# Altium schematic sheet MCU_Schematic_Winterbreak.SchDoc
size C; SheetNumber: 1; SheetTotal: 1
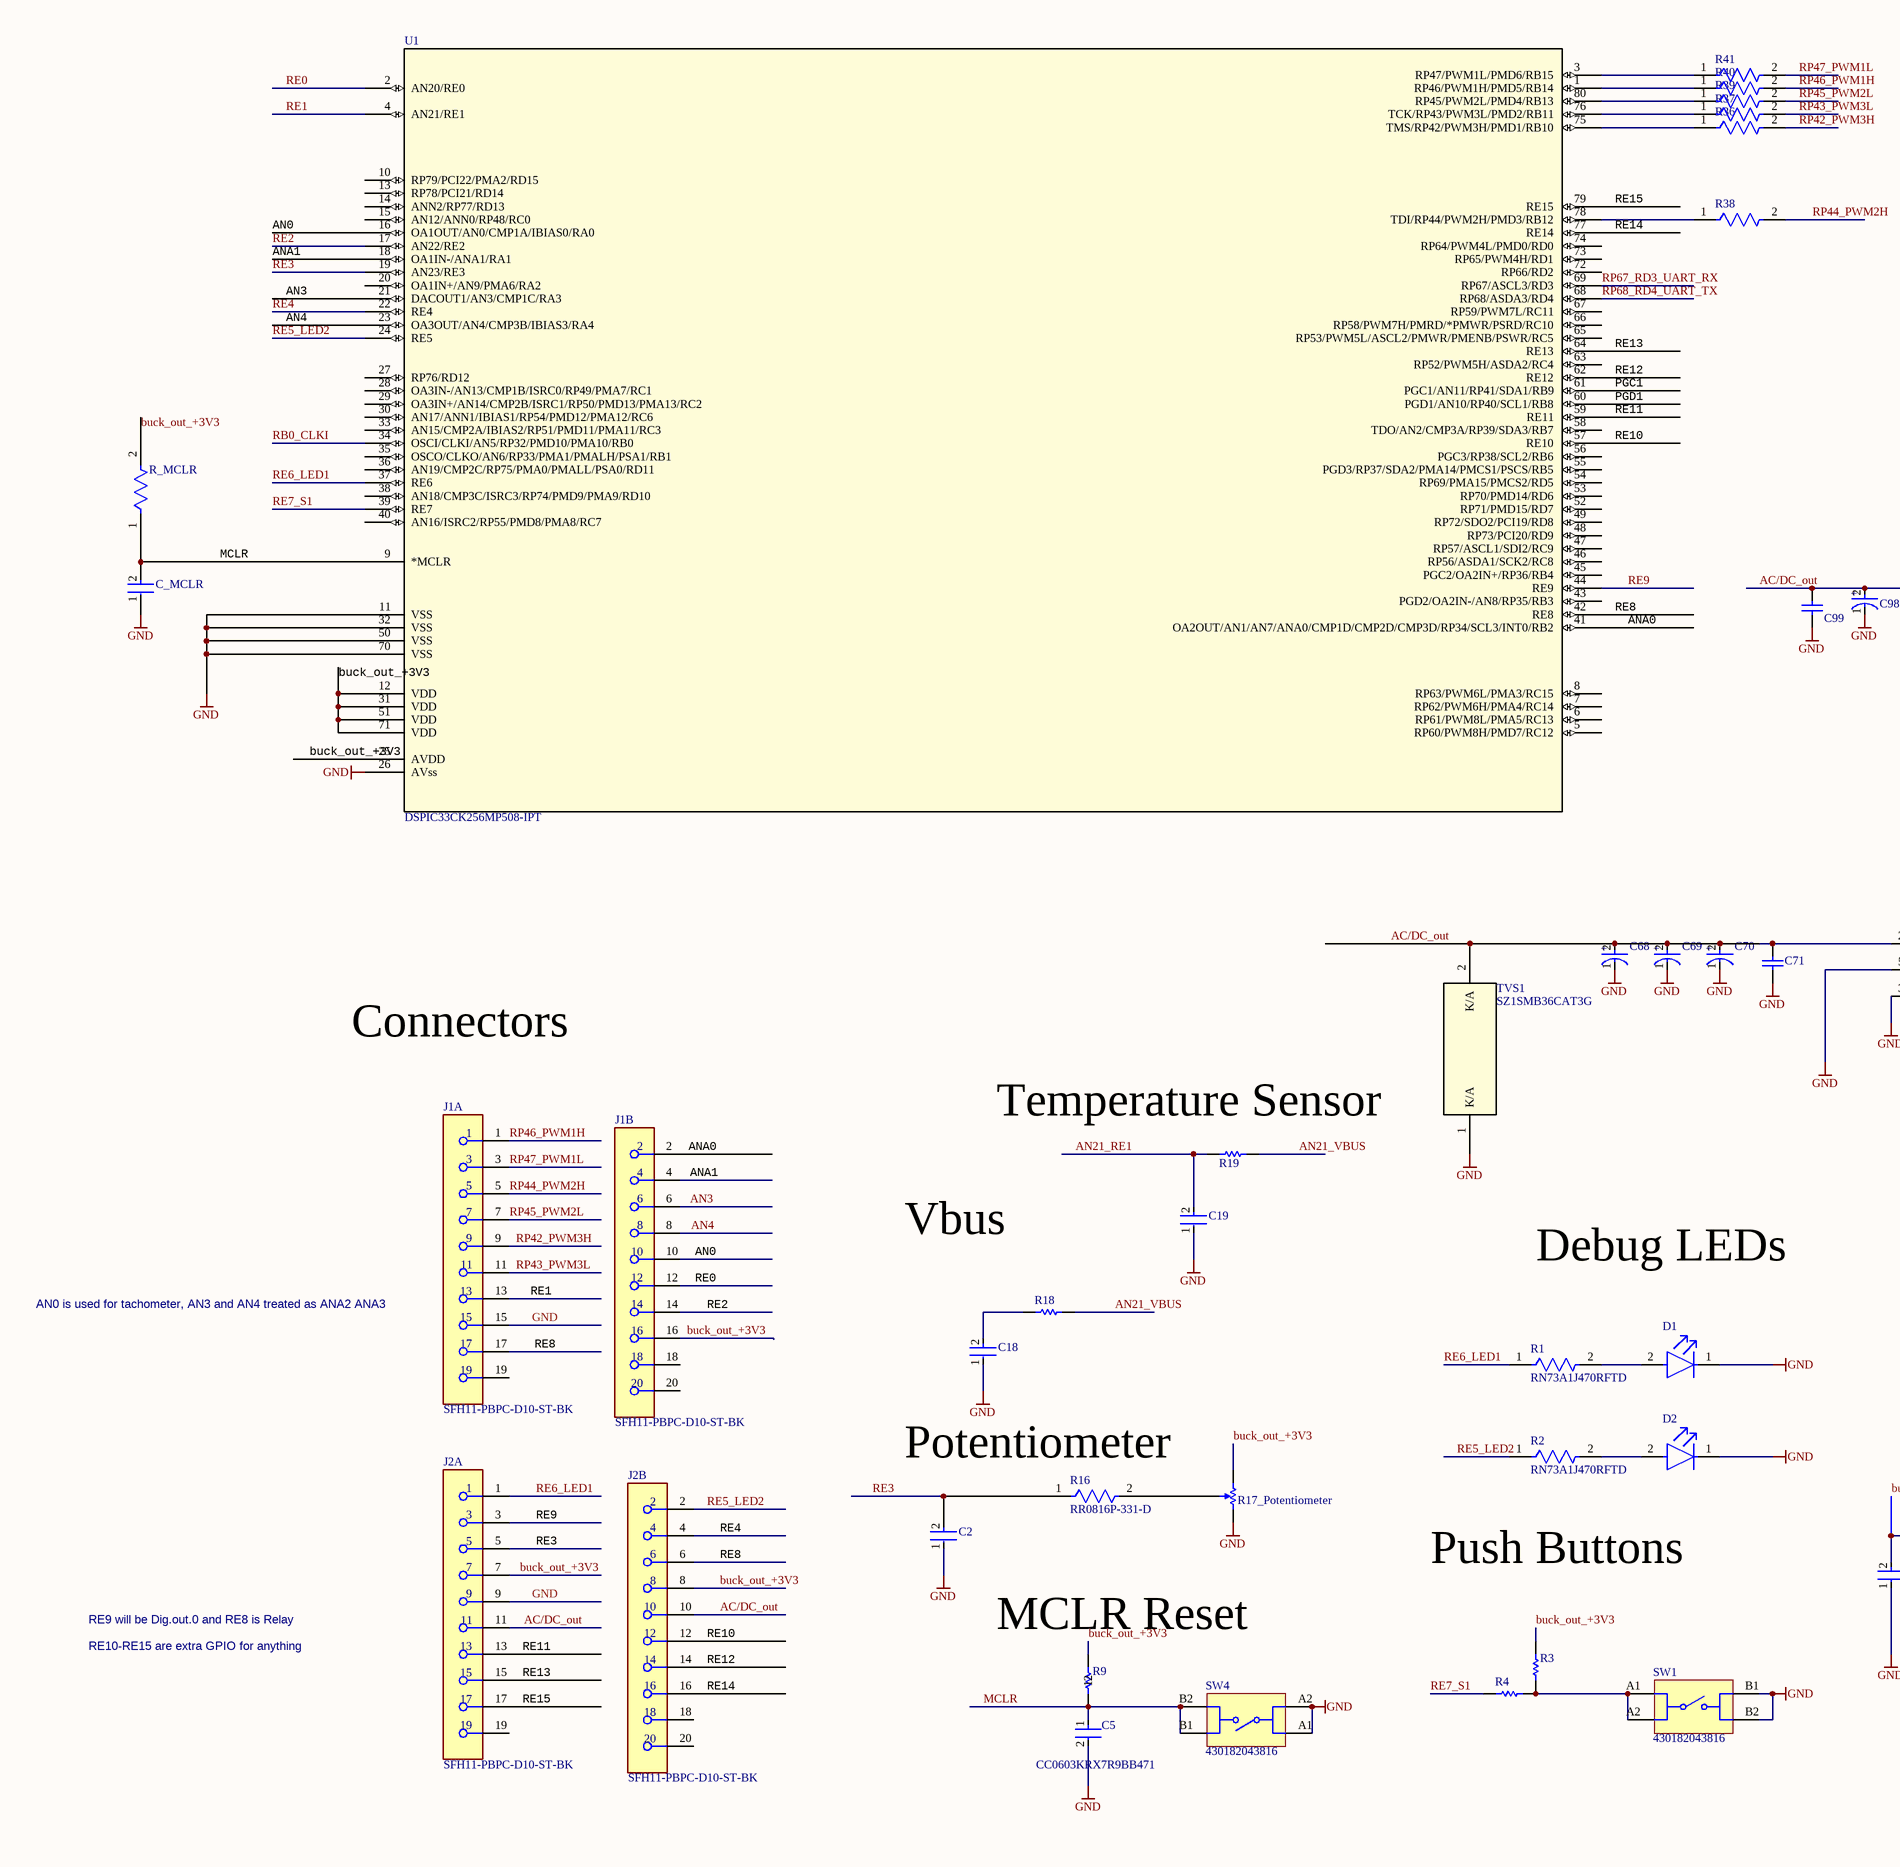
[diagram p0: MCU_Schematic_Winterbreak.SchDoc, left]
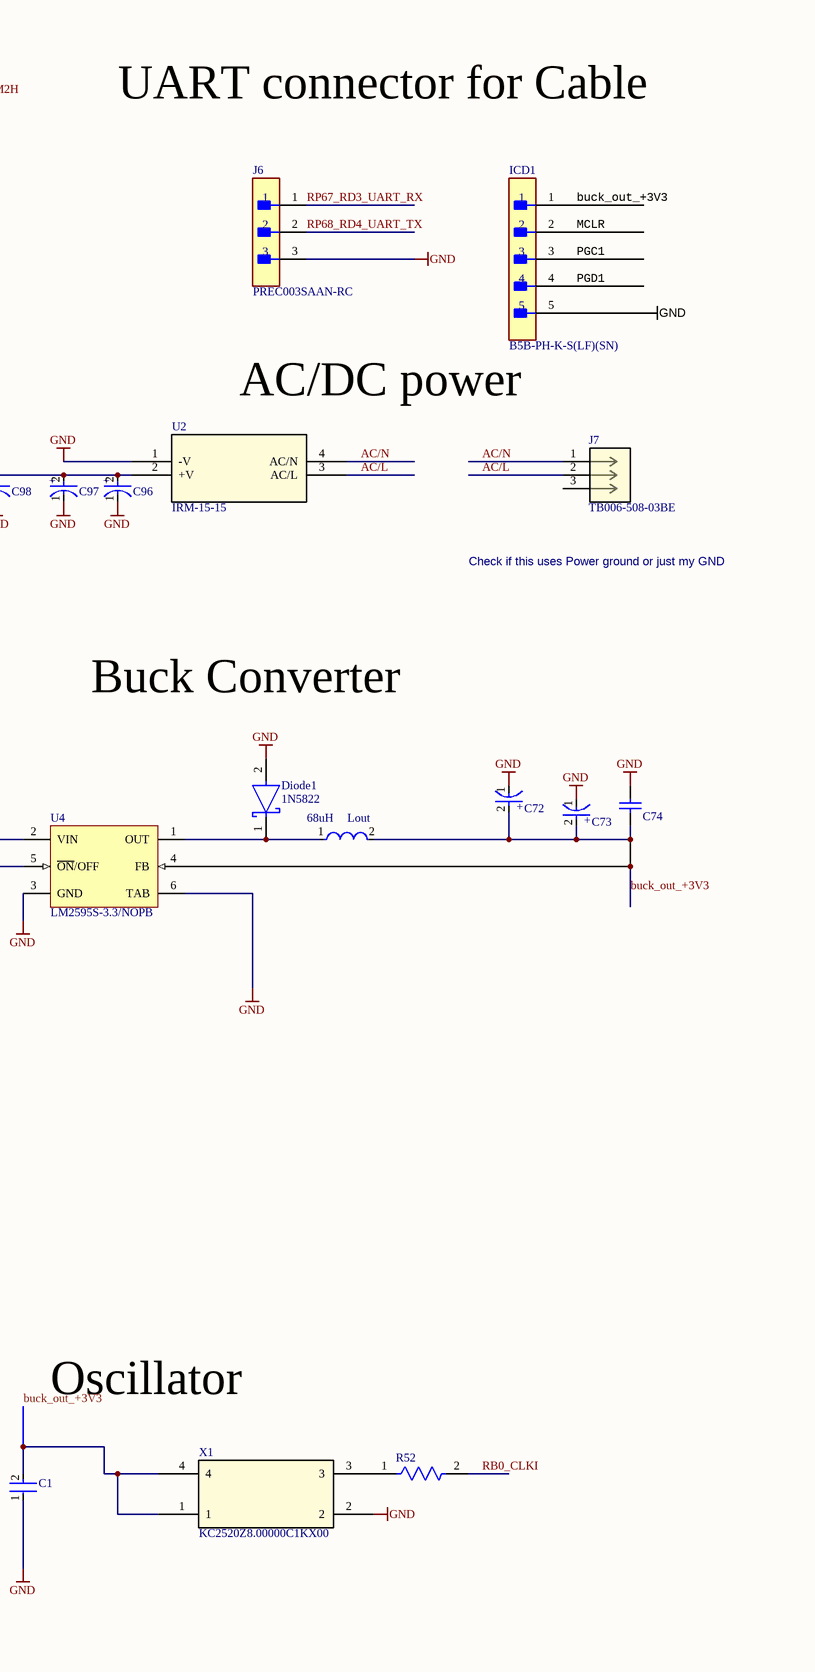
[diagram p1: MCU_Schematic_Winterbreak.SchDoc, right]

## Parts
C1  GRM155R71C104KA88D  [FP-GRM15-MFG]  (value not drawn)
C2  GRM155R71C104KA88D  [FP-GRM15-MFG]  (value not drawn)
C5  CC0603KRX7R9BB471  [FP-CC0603-DA-MFG]
C18  GRM155R71C104KA88D  [FP-GRM15-MFG]  (value not drawn)
C19  GRM155R71C104KA88D  [FP-GRM15-MFG]  (value not drawn)
C68  EEHAZS1H221B  [FP-EEHA-G16-MFG]  (value not drawn)
C69  EEHAZS1H221B  [FP-EEHA-G16-MFG]  (value not drawn)
C70  TAJE476K035RNJ  [FP-TAJE-MFG]  (value not drawn)
C71  08055C104KAZ2A  [CAPC2013X94X50NL20T25]  (value not drawn)
C72  EEHAZS1H221B  [FP-EEHA-G16-MFG]  (value not drawn)
C73  TAJE476K035RNJ  [FP-TAJE-MFG]  (value not drawn)
C74  08055C104KAZ2A  [CAPC2013X94X50NL20T25]  (value not drawn)
C96  EEHAZS1H221B  [FP-EEHA-G16-MFG]  (value not drawn)
C97  EEHAZS1H221B  [FP-EEHA-G16-MFG]  (value not drawn)
C98  TAJE476K035RNJ  [FP-TAJE-MFG]  (value not drawn)
C99  08055C104KAZ2A  [CAPC2013X94X50NL20T25]  (value not drawn)
C_MCLR  GRM155R71C104KA88D  [FP-GRM15-MFG]  (value not drawn)
D1  LTST-C190KGKT  [FP-LTST-C190KGKT-MFG]  (value not drawn)
D2  LTST-C190KGKT  [FP-LTST-C190KGKT-MFG]  (value not drawn)
Diode1  1N5822  [FP-DO-201AD-MFG]
ICD1  B5B-PH-K-S(LF)(SN)  [FP-B5B-PH-K-S_LF_SN-MFG]
J1  SFH11-PBPC-D10-ST-BK  [FP-SFH11-PBPC-D10-ST-BK-MFG]  (parts A,B of 2)
J2  SFH11-PBPC-D10-ST-BK  [FP-SFH11-PBPC-D10-ST-BK-MFG]  (parts A,B of 2)
J6  PREC003SAAN-RC  [FP-PREC003SAAN-RC-MFG]
J7  TB006-508-03BE  [CONN3_TB006-508_CUD]
Lout  Inductance: 68uH  [FP-NR6028-MFG]  (hidden comment: NR6028T680M)
R1  RN73A1J470RFTD  [FP-RN731J-MFG]
R2  RN73A1J470RFTD  [FP-RN731J-MFG]
R3  ERJ3EKF1002V  [RESC1609X55X30LL15T15]  (value not drawn)
R4  ERJ-3EKF1001V  [RESC1608X55X30LL15T15]  (value not drawn)
R9  ERJ3EKF1002V  [RESC1609X55X30LL15T15]  (value not drawn)
R16  RR0816P-331-D  [FP-RR0816-IPC_C]
R17_Potentiometer  P090S-14T20BR10K  [RES-POT-3]  (value not drawn)
R18  ERJ-3EKF1000V  [RESC1608X55X30LL15T15]  (value not drawn)
R19  ERJ3EKF1002V  [RESC1609X55X30LL15T15]  (value not drawn)
R36  RR0816Q-750-D  [FP-RR0816-IPC_B]  (value not drawn)
R37  RR0816Q-750-D  [FP-RR0816-IPC_B]  (value not drawn)
R38  RR0816Q-750-D  [FP-RR0816-IPC_B]  (value not drawn)
R39  RR0816Q-750-D  [FP-RR0816-IPC_B]  (value not drawn)
R40  RR0816Q-750-D  [FP-RR0816-IPC_B]  (value not drawn)
R41  RR0816Q-750-D  [FP-RR0816-IPC_B]  (value not drawn)
R52  RR0816Q-750-D  [FP-RR0816-IPC_B]  (value not drawn)
R_MCLR  ESR03EZPJ103  [FP-ESR03-IPC_C]  (value not drawn)
SW1  430182043816  [430182043816]
SW4  430182043816  [430182043816]
TVS1  SZ1SMB36CAT3G  [SMB-2_4P60X3P95_ONS]
U1  DSPIC33CK256MP508-IPT  [TQFP80_PT_MCH]
U2  IRM-15-15  [IRM-15_MWU]
U4  LM2595S-3.3/NOPB  [KTT0005B_N]
X1  KC2520Z8.00000C1KX00  [OSC_0C1KX00_AVX]

## Nets
GND: C1.1 C2.1 C5.2 C18.1 C19.1 C68.1(C) C69.1(C) C70.1(C) C71.1 C72.1(C) C73.1(C) C74.1 C96.1(C) C97.1(C) C98.1(C) C99.1 C_MCLR.1 D1.1(C) D2.1(C) Diode1.2(A) ICD1.5 J1.15 J2.9 J6.3 R17_Potentiometer.3 SW1.B1 SW1.B2 SW4.A1 SW4.A2 TVS1.1(K/A) U1.11(VSS) U1.26(AVss) U1.32(VSS) U1.50(VSS) U1.70(VSS) U2.1(-V) U4.3(GND) U4.5(~{ON}/OFF) U4.6(TAB) X1.2
AC/DC_out: C68.2(A) C69.2(A) C70.2(A) C71.2 C96.2(A) C97.2(A) C98.2(A) C99.2 J2.10 J2.11 TVS1.2(K/A) U2.2(+V) U4.2(VIN)
AC/L: J7.2 U2.3(AC/L)
AC/N: J7.1 U2.4(AC/N)
AN0: J1.10 U1.16(OA1OUT/AN0/CMP1A/IBIAS0/RA0)
AN3: J1.6 U1.21(DACOUT1/AN3/CMP1C/RA3)
AN4: J1.8 U1.23(OA3OUT/AN4/CMP3B/IBIAS3/RA4)
AN21_RE1: C19.2 R19.2
AN21_VBUS: R18.2 R19.1
ANA0: J1.2 U1.41(OA2OUT/AN1/AN7/ANA0/CMP1D/CMP2D/CMP3D/RP34/SCL3/INT0/RB2)
ANA1: J1.4 U1.18(OA1IN-/ANA1/RA1)
buck_out_+3V3: C1.2 C72.2(A) C73.2(A) C74.2 ICD1.1 J1.16 J2.7 J2.8 Lout.2 R3.2 R9.2 R17_Potentiometer.1 R_MCLR.2 U1.12(VDD) U1.25(AVDD) U1.31(VDD) U1.51(VDD) U1.71(VDD) U4.4(FB) X1.1 X1.4
MCLR: C5.1 C_MCLR.2 ICD1.2 R9.1 R_MCLR.1 SW4.B1 SW4.B2 U1.9(*MCLR)
PGC1: ICD1.3 U1.61(PGC1/AN11/RP41/SDA1/RB9)
PGD1: ICD1.4 U1.60(PGD1/AN10/RP40/SCL1/RB8)
RB0_CLKI: R52.2 U1.34(OSCI/CLKI/AN5/RP32/PMD10/PMA10/RB0)
RE0: J1.12 U1.2(AN20/RE0)
RE1: J1.13 U1.4(AN21/RE1)
RE2: J1.14 U1.17(AN22/RE2)
RE3: C2.2 J2.5 R16.1 U1.19(AN23/RE3)
RE4: J2.4 U1.22(RE4)
RE5_LED2: J2.2 R2.1 U1.24(RE5)
RE6_LED1: J2.1 R1.1 U1.37(RE6)
RE7_S1: R4.1 U1.39(RE7)
RE8: J1.17 J2.6 U1.42(RE8)
RE9: J2.3 U1.44(RE9)
RE10: J2.12 U1.57(RE10)
RE11: J2.13 U1.59(RE11)
RE12: J2.14 U1.62(RE12)
RE13: J2.15 U1.64(RE13)
RE14: J2.16 U1.77(RE14)
RE15: J2.17 U1.79(RE15)
RP42_PWM3H: J1.9 R36.2
RP43_PWM3L: J1.11 R37.2
RP44_PWM2H: J1.5 R38.2
RP45_PWM2L: J1.7 R39.2
RP46_PWM1H: J1.1 R40.2
RP47_PWM1L: J1.3 R41.2
RP67_RD3_UART_RX: J6.1 U1.69(RP67/ASCL3/RD3)
RP68_RD4_UART_TX: J6.2 U1.68(RP68/ASDA3/RD4)
NetC18_2: C18.2 R18.1
NetD1_2: D1.2(A) R1.2
NetD2_2: D2.2(A) R2.2
NetDiode1_1: Diode1.1(C) Lout.1 U4.1(OUT)
NetR3_1: R3.1 R4.2 SW1.A1 SW1.A2
NetR16_2: R16.2 R17_Potentiometer.2
NetR36_1: R36.1 U1.75(TMS/RP42/PWM3H/PMD1/RB10)
NetR37_1: R37.1 U1.76(TCK/RP43/PWM3L/PMD2/RB11)
NetR38_1: R38.1 U1.78(TDI/RP44/PWM2H/PMD3/RB12)
NetR39_1: R39.1 U1.80(RP45/PWM2L/PMD4/RB13)
NetR40_1: R40.1 U1.1(RP46/PWM1H/PMD5/RB14)
NetR41_1: R41.1 U1.3(RP47/PWM1L/PMD6/RB15)
NetR52_1: R52.1 X1.3

Not connected (* = marked no-connect by the designer): J1 18 19 20; J2 18 19 20; J7 3; U1 5(RP60/PWM8H/PMD7/RC12) 6(RP61/PWM8L/PMA5/RC13) 7(RP62/PWM6H/PMA4/RC14) 8(RP63/PWM6L/PMA3/RC15) 10(RP79/PCI22/PMA2/RD15) 13(RP78/PCI21/RD14) 14(ANN2/RP77/RD13) 15(AN12/ANN0/RP48/RC0) 20(OA1IN+/AN9/PMA6/RA2) 27(RP76/RD12) 28(OA3IN-/AN13/CMP1B/ISRC0/RP49/PMA7/RC1) 29(OA3IN+/AN14/CMP2B/ISRC1/RP50/PMD13/PMA13/RC2) 30(AN17/ANN1/IBIAS1/RP54/PMD12/PMA12/RC6) 33(AN15/CMP2A/IBIAS2/RP51/PMD11/PMA11/RC3) 35(OSCO/CLKO/AN6/RP33/PMA1/PMALH/PSA1/RB1) 36(AN19/CMP2C/RP75/PMA0/PMALL/PSA0/RD11) 38(AN18/CMP3C/ISRC3/RP74/PMD9/PMA9/RD10) 40(AN16/ISRC2/RP55/PMD8/PMA8/RC7) 43(PGD2/OA2IN-/AN8/RP35/RB3) 45(PGC2/OA2IN+/RP36/RB4) 46(RP56/ASDA1/SCK2/RC8) 47(RP57/ASCL1/SDI2/RC9) 48(RP73/PCI20/RD9) 49(RP72/SDO2/PCI19/RD8) 52(RP71/PMD15/RD7) 53(RP70/PMD14/RD6) 54(RP69/PMA15/PMCS2/RD5) 55(PGD3/RP37/SDA2/PMA14/PMCS1/PSCS/RB5) 56(PGC3/RP38/SCL2/RB6) 58(TDO/AN2/CMP3A/RP39/SDA3/RB7) 63(RP52/PWM5H/ASDA2/RC4) 65(RP53/PWM5L/ASCL2/PMWR/PMENB/PSWR/RC5) 66(RP58/PWM7H/PMRD/*PMWR/PSRD/RC10) 67(RP59/PWM7L/RC11) 72(RP66/RD2) 73(RP65/PWM4H/RD1) 74(RP64/PWM4L/PMD0/RD0)

## Notes on the sheet
- UART connector for Cable
- AC/DC power
- Check if this uses Power ground or just my GND
- Buck Converter
- Connectors
- (near R19) Temperature Sensor
- Vbus
- AN0 is used for tachometer, AN3 and AN4 treated as ANA2 ANA3
- Debug LEDs
- Potentiometer
- Oscillator
- Push Buttons
- RE9 will be Dig.out.0 and RE8 is Relay
- RE10-RE15 are extra GPIO for anything
- (near R9) MCLR Reset
- (in symbol CMP-04424-000247-1) +
- (in symbol CMP-05428-000537-1) +

## Library data of the parts
C1 C2 C18 C19 = CMP-2100-03641-2: CAP CER 0.1UF 16V X7R 0402; Manufacturer: Murata; Standoff Height: 0mm; Tolerance: 10%; Voltage Rating: 16Vdc; Material: Ceramic; Capacitance: 0.10μF; Value: 0.10μF; RoHS: TRUE; Manufacturer Part Number: GRM155R71C104KA88D; Temperature Characteristic: X7R; Octopart: https://octopart.com/grm155r71c104ka88d-murata-196880; Digikey Description: CAP CER 0.1UF 16V X7R 0402; Device Class L3: Ceramic Capacitors; Height: 0.55mm; ComponentLink2Description: Datasheet; Temperature Range Low: -55°C; Ipc Land Pattern Name: CAPC10050X219; ComponentLink2URL: https://search.murata.co.jp/Ceramy/image/img/A01X/G101/ENG/GRM155R71H471KA01-01A.pdf; Device Class L1: Passive Components; Lead Free: yes; Category: Cap; Package: GRM15; Temperature: -55°C to +125°C; Device Class L2: Capacitors; Temperature Range High: +125°C; Mouser Description: 0402 0.1 uF 16V ±10 % Tolerance X7R SMT Multilayer Ceramic Capacitor
C5 = CMP-03422-001072-1: CAP CER 470PF 50V X7R 0603; Manufacturer: YAGEO; Material: Ceramic; Temperature Coefficient: 15%; Tolerance: 0.1; Manufacturer Part Number: CC0603KRX7R9BB471; Category: Cap; Voltage: 50 V; Device Class L1: Passive Components; ComponentLink2URL: http://www.yageo.com/documents/recent/UPY-GPHC_X7R_6.3V-to-50V_18.pdf; Digikey Description: CAP CER 470PF 50V X7R 0603; Temperature Characteristic: X7R; Mouser Description: Multilayer Ceramic Capacitors MLCC - SMD/SMT 470pF 50V X7R 10%; RoHS: TRUE; Footprint Url: http://www.yageo.com/exep/pages/download/literatures/UPY-C_GEN_24.pdf; Octopart: https://octopart.com/cc0603krx7r9bb471-yageo-192931; Value: 470 pF; Height: 0.9mm; ComponentLink2Description: Datasheet; Voltage Rating: 50 V; Automotive: No; Capacitance: 470 pF; Temperature: -55°C to +125°C; Device Class L3: Ceramic Capacitors; Temperature Range Low: -55°C; Package: CC0603-DA; Temperature Range High: +125°C; Lead Free: Yes; Device Class L2: Capacitors
C68 C69 C72 C96 C97 = CMP-05428-000537-1: Conductive Polymer Hybrid Aluminum Electrolytic Capacitors 220uF ±20% 50V RADIAL TH 10x15.7mm; RoHS Compliant: Yes
C70 C73 C98 = CMP-04424-000247-1: 47uF 35V  ±10% 900mΩ 2917  SMD Tantalum Capacitor; Polarity: Polar; Dissipation Factor: 6%; Leakage Current: 16.5uA; ESR (Equivalent Series Resistance): 900mR; Voltage Rating: 35V; Max Operating Temperature: 125°C; Voltage: 35V; RoHS Compliant: Yes; Case Code (Metric): 7343; Tolerance: 10%; Series: TAJ; Voltage Rating (DC): 35V; Height: 4.1mm; Width: 0.169inch; Lead Free: Lead Free; REACH SVHC: No SVHC; Case/Package: 2917; Packaging: Tape and Reel; Capacitance: 47uF; Radiation Hardening: No; Case Code (Imperial): 2917; Dielectric Material: Tantalum; Depth: 4.3mm; Mount: Surface Mount; Height - Seated (Max): 0.169inch; Termination: SMD/SMT; Min Operating Temperature: -55°C; Construction: Flat; Features: General Purpose; Length: 7.3mm; Package Quantity: 1
C71 C74 C99 = CMP-2007-04372-1: Manufacturer: AVX Interconnect / Elco; Part Number: 08055C104KAZ2A
C_MCLR = CMP-2100-03641-2: CAP CER 0.1UF 16V X7R 0402; Manufacturer: Murata; Standoff Height: 0mm; Tolerance: 10%; Voltage Rating: 16Vdc; Capacitance: 0.10μF; Value: 0.10μF; RoHS: TRUE; Manufacturer Part Number: GRM155R71C104KA88D; Temperature Characteristic: X7R; Octopart: https://octopart.com/grm155r71c104ka88d-murata-196880; Digikey Description: CAP CER 0.1UF 16V X7R 0402; Device Class L3: Ceramic Capacitors; Height: 0.55mm; ComponentLink2Description: Datasheet; Temperature Range Low: -55°C; Ipc Land Pattern Name: CAPC10050X219; ComponentLink2URL: https://search.murata.co.jp/Ceramy/image/img/A01X/G101/ENG/GRM155R71H471KA01-01A.pdf; Device Class L1: Passive Components; Lead Free: yes; Category: Cap; Package: GRM15; Temperature: -55°C to +125°C; Device Class L2: Capacitors; Material: Ceramic; Temperature Range High: +125°C; Mouser Description: 0402 0.1 uF 16V ±10 % Tolerance X7R SMT Multilayer Ceramic Capacitor
D1 D2 = CMP-2000-05197-2: LED GREEN CLEAR CHIP SMD; Test Current: 20mA; Power Rating: 75mW; Forward Voltage: 2V; Wavelength: 574nm; Number of LEDs: 1; Reverse Voltage: 5V; Dominant Wavelength: 571nm; Lens Style: Diffused; Luminous Intensity: 35mcd; Forward Current: 30mA; Viewing Angle: 130°; Lens Color: Colorless; Width: 0.8mm; Case Code (Imperial): 0603; Case Code (Metric): 1608; Number of Pins: 2; Radiation Hardening: No; Package Quantity: 1; Lead Free: Lead Free; Lens Transparency: Clear; Depth: 0.8mm; Power Dissipation: 75mW; Mount: Surface Mount; Max Operating Temperature: 85°C; Case/Package: 0603; Height: 0.8mm; Illumination Color: Green; Color: Green; Length: 1.6mm; Packaging: Tape and Reel; Number of Elements: 1; Min Operating Temperature: -55°C
Diode1 = CMP-12187-000025-1: DIODE SCHOTTKY 40V 3A DO201AD; Manufacturer: STMicroelectronics; Max Junction Temp: +150°C; Peak Reverse Current: 2mA; Max Surge Forward Current: 80A; Temperature Range High: +150°C; Automotive: No; RoHS: TRUE; ComponentLink2Description: Datasheet; Manufacturer Part Number: 1N5822; Lead Free: Yes; Octopart: https://octopart.com/1n5822-stmicroelectronics-323225; Device Class L2: Diodes; Max Repetitive Reverse Voltage: 40V; Temperature: to +150°C; Height: 5.3mm; Category: Diode; Digikey Description: DIODE SCHOTTKY 40V 3A DO201AD; ComponentLink2URL: https://www.st.com/resource/en/datasheet/1n5822.pdf; Device Class L3: Schottky Diodes; Device Class L1: Discrete Semiconductors; Forward Current: 3A; Mouser Description: Schottky Diodes & Rectifiers Vr/40V Io/3A BULK; Package: DO-201AD
ICD1 = CMP-2000-05908-2: CONN HEADER VERT 5POS 2MM; Voltage Rating (AC): 100V; Number of Positions: 5; Contact Resistance: 20mR; Insulation Resistance: 1MR; Current Rating: 2A; Gender: Male; Mated Stacking Heights: 8mm; Series: PH; Number of Poles: 5; Width: 4.5mm; Insulation Color: Natural; Fastening Type: Detent; Flammability Rating: UL94 V-0; Mount: Through Hole; Lead Free: Lead Free; Number of Rows: 1; REACH SVHC: No SVHC; Max Voltage Rating (AC): 100V; Contact Mating Length: 0.13inch; Contact Plating: Tin; Housing Material: Polyamide; Depth: 4.5mm; Contact Type: Male Pin; Voltage Rating: 100V; Color: Natural; Housing Color: White; Lead Pitch: 2mm; Number of Contacts: 5; Orientation: Straight; Packaging: Bulk; Contact Material: Brass; Pitch: 2mm; Insulation Material: Nylon; Connector Type: Header; Contact Finish - Mating: TIN; Termination: Solder; Number of Pins: 5; Length: 11.9mm; Contact Shape: Square; Max Current Rating: 2A; Working Voltage: 100V; Min Operating Temperature: -25°C; Max Operating Temperature: 85°C; Material: Polyamide; Height: 9.4mm
J1 J2 = CMP-25680-000028-1: CONN HDR 20POS 0.1 GOLD PCB; Row Spacing: 0.1inch; Connector Type: Header; Number of Positions: 20; Lead Free: Lead Free; Termination: Solder; Number of Rows: 2; Packaging: Tray; Contact Plating: Gold; Pitch: 0.1inch; Mount: Through Hole; Color: Black; Package Quantity: 1
J6 = CMP-00595-22265080-1: PREC003SAAN-RC Conn Header Vert 3POS 2.54MM; Number of Contacts: 3; Connector Type: Male Pin; Current Rating: 3A; Height: 8.74mm; Contact Mating Length: 5.842mm; Min Operating Temperature: -40°C; Termination: Solder; Packaging: Bulk; Pitch: 2.54mm; Color: Black; Mount: Through Hole; Contact Material: Nickel, Tin; Number of Rows: 1; NexarPartId: 22265080; Max Operating Temperature: 105°C; RoHS: Compliant; Contact Plating: Tin; Number of Positions: 3
J7 = TB006-508-03BE: No Description Available; Mfr_Name: Same Sky; Type: Wire to Board; Digi-Key_Part_Number_1: 102-6192-ND; RefDes: RefDes
Lout = CMP-14484-000870-1: SMD Power Inductors 68uH ±20% 0.76A 0.546Ω; Self Resonant Frequency: 5MHz; Saturation Current: 760mA; Max DC Current: 770mA; Test Frequency: 100kHz; DC Resistance (DCR): 546mR; Shielding: Shielded; Core Material: Ferrite; Height: 2.8mm; Length: 0.236inch; Width: 0.236inch; Case/Package: Nonstandard; Mount: Surface Mount; Height - Seated (Max): 0.11inch; Package Quantity: 2000; Tolerance: 20%; Packaging: Tape and Reel; Radiation Hardening: No; Halogen Free: Halogen Free; Resistor Type: Wirewound; Number of Pins: 2; Depth: 6.2mm; Min Operating Temperature: -25°C; Current Rating: 770mA; Series: NR; RoHS Compliant: Yes; RMS Current (Irms): 770mA; Inductance Tolerance: 20%; Max Operating Temperature: 120°C; Termination: SMD/SMT
R1 R2 = CMP-03211-000951-1: 42; Manufacturer: TE Connectivity; Resistance: 470Ω; Voltage Rating: 50V; Power Rating: 0.063W; Value: 470Ω; Temperature Coefficient: 5ppm/°C; Temperature Range High: +155°C; ComponentLink2Description: Datasheet; Series: RN73; Octopart: https://octopart.com/rn73a1j470rftd-te+connectivity-22740827; Package: RN731J; Temperature Range Low: -55°C; Ipc Land Pattern Name: RESC15580X45; Category: Res; Device Class L3: Chip SMD Resistors; Lead Free: Yes; Tolerance: 42; Composition: Thin Film; Height: 0.55mm; Device Class L1: Passive Components; Device Class L2: Resistors; Automotive: No; packaging: 5000 Reel; RoHS: TRUE; Temperature: -55°C to +155°C; octopart_url: https://octopart.com/rn73a1j470rftd-te+connectivity-22740827; ComponentLink2URL: https://www.te.com/commerce/DocumentDelivery/DDEController?Action=showdoc&DocId=Data+Sheet%7F1773270%7FP%7Fpdf%7FEnglish%7FENG_DS_1773270_P.pdf%7F9-1614352-9; Manufacturer Part Number: RN73A1J470RFTD
R3 R9 R19 = CMP-1012-00623-3: Chip Resistor, 10 KOhm, +/- 1%, 0.1 W, -55 to 155 degC, 0603 (1608 Metric), RoHS, Tape and Reel; Manufacturer: Panasonic; Voltage Rating: 75V; Case\/Package: 0603; Power Rating: 100mW; Resistance: 10KOhm; Temperature Coefficient: 100ppm\/degreesC; Number of Pins: 2; Package Reference: 603; Depth: 0.8mm; Mount: SurfaceMount; Package Description: 2-Pin Surface Mount Device, Body 1.6 x 0.85 mm; Datasheet Version: 02/2017; Length: 1.6mm; Lead Free: LeadFree; Height: 0.45mm; Number of Terminations: 2; Max Power Dissipation: 100mW; Min Operating Temperature: -55degC; Datasheet URL: https://industrial.panasonic.com/cdbs/www-data/pdf/RDA0000/AOA0000C304.pdf; Termination: SMD/SMT; Case Code (Metric): 1608; Case Code (Imperial): 0603; Tolerance: 1%; Max Operating Temperature: 155degC; RoHSCompliant: true; Voltage Rating (DC): 75V; Radiation Hardening: No; Packaging: TapeandReel; Composition: ThickFilm; Mounting Technology: SurfaceMount; Manufacturer URL: http://www.panasonic.com/; Width: 0.031inch; REACH SVHC: NoSVHC; Contact Plating: Tin; Military Standard: Not; Package Quantity: 1
R4 = CMP-2000-00180-1: Manufacturer: Panasonic; Part Number: ERJ-3EKF1001V
R16 = CMP-2000-02614-2: 330Ω ±0.5% 0.0625W 1/16W Chip Resistor 0603 (1608 Metric) Thin Film; Voltage Rating: 75V; Max Power Dissipation: 63mW; Resistance: 330R; Temperature Coefficient: 25ppm/°C; Resistance Tolerance: 0.5%; Tolerance: 0.5%; Lead Free: Lead Free; Min Operating Temperature: -55°C; Termination: SMD/SMT; Height: 0.4mm; Technology: THIN FILM; Size Code: 0603; Depth: 0.8mm; Packaging: Tape and Reel; RoHS Compliant: Yes; Case/Package: 0603; Number of Pins: 2; Number of Terminations: 2; Length: 1.6mm; Package Quantity: 5000; Case Code (Imperial): 0603; Max Operating Temperature: 125°C; Series: RR; Width: 0.8mm; Resistor Type: Thin Film; Power Rating: 63mW; Case Code (Metric): 1608; Voltage Rating (DC): 75V
R17_Potentiometer = CMP-2000-06871-1: 9 mm Rotary Potentiometer, Insulated Shaft, Conductive Plastic Element, 10 KOhm, -20 to 70 degC, 3-Pin THD, RoHS, Tray; Manufacturer: BI Technologies; Actuator Type: Knurled; Power Rating: 0.03W; Tolerance: ±20%; Actuator Diameter: 0.236"(6.00mm); Other Names: 987-1277P090S14T20BR10K; Actuator Length: 0.787"(20.00mm); Number of Gangs: 1; Online Catalog: P090Series; Power (Watts): 0.03W,1/32W; Built in Switch: Detent; Resistance (Ohms): 10k; Adjustment Type: TopAdjustment; Rotation: 280°; Package Description: POT, 3-Leads, Body 9.8 x 12.5 mm, Pitch 2.5 mm; Bushing Thread: -; Package Reference: POT-3; Datasheet URL: http://www.bitechnologies.com/pdfs/p090.pdf; Packaging: Tray; Manufacturer URL: http://www.bi-technologies.net/; Package URL: http://www.bitechnologies.com/pdfs/p090.pdf; Mounting Technology: ThroughHole; Datasheet Version: 07/2008; Taper: Linear; Resistive Material: ConductivePlastic; Mounting Type: ThroughHole; Temperature Coefficient: -; Standard Package: 1; Category: Potentiometers,VariableResistors; Family: RotaryPotentiometers,Rheostats; Termination Style: PCBPins,BoardLocks; Series: P090; Number of Turns: 1
R18 = CMP-2000-00179-1: Manufacturer: Panasonic; Part Number: ERJ-3EKF1000V
R36-R41 R52 = CMP-2000-02813-2: 75Ω ±0.5% 0.0625W 1/16W Chip Resistor 0603 (1608 Metric) Thin Film; Voltage Rating (DC): 75V; Resistance: 75R; Power Rating: 62.5mW; Temperature Coefficient: 50ppm/°C; Max Power Dissipation: 63mW; Case Code (Imperial): 0603; Packaging: Tape and Reel; Termination: SMD/SMT; Depth: 0.8mm; Case/Package: 0603; Resistor Type: Thin Film; Tolerance: 0.5%; Width: 0.031inch; Series: RR; Height: 0.4mm; Voltage Rating: 75V; Size Code: 0603; Lead Free: Lead Free; Max Operating Temperature: 125°C; Number of Terminations: 2; Case Code (Metric): 1608; Min Operating Temperature: -55°C; Package Quantity: 1; Technology: THIN FILM; RoHS Compliant: Yes; Length: 1.6mm; Number of Pins: 2; Mount: Surface Mount
R_MCLR = CMP-08839-028975-1: 10kΩ ±5% 0.25W 0603 Anti-Surge Chip Resistor AEC-Q200; Resistance: 10kR; Power Rating: 250mW; Temperature Coefficient: 200ppm/°C; Tolerance: 5%; Series: ESR03; Package Quantity: 5000; Length: 0.063inch; Height: 0.022inch; Lead Free: Lead Free; Case/Package: 0603; Case Code (Metric): 1608; Width: 0.031inch; Resistor Type: Thick Film; Max Power Dissipation: 250mW; Packaging: Tape and Reel; Mount: Surface Mount; Number of Terminations: 2; Case Code (Imperial): 0603; Max Operating Temperature: 155°C; Min Operating Temperature: -55°C; RoHS Compliant: Yes
SW1 SW4 = CMP-1452-00013-3: Switch Tactile N.O. SPST Round Button Gull Wing 0.05A 12VDC 1000000Cycles 1.57N SMD Reel; Switch Travel: 250µm; Current Rating: 50mA; Mechanical Life: 1Mcycles; Actuator Length: 900µm; Insulation Resistance: 100MΩ; Actuator Material: Liquid Crystal Polymer, Polymer; Switch Function: Off-Mom; Illumination Type: Illuminated, Non-Illuminated; Voltage Rating: 12V; REACH SVHC: No SVHC; Contact Current Rating: 50mA; RoHS: Compliant; Length: 6.2mm; Throw Configuration: SPST; Termination: Gull Wing; Contact Plating: Silver; Mount: Surface Mount; Diameter: 3.5mm; Color: Black; Width: 6.2mm; Height: 4.3mm; Contact Material: Stainless Steel, Steel; Max Operating Temperature: 85°C; Packaging: Tape and Reel; Min Operating Temperature: -40°C; Lead Free: Lead Free; Contact Resistance: 100mΩ
TVS1 = SZ1SMB36CAT3G: No Description Available; Mfr_Name: onsemi; RefDes: RefDes; Type: Type
U1 = DSPIC33CK256MP508-IPT: No Description Available; Mfr_Name: Microchip; RefDes: RefDes; Type: Type
U2 = IRM-15-15: No Description Available; Mfr_Name: Mean Well; RefDes: RefDes; Type: Type
U4 = CMP-0069-00229-3: SIMPLE SWITCHER® Power Converter 150 KHz 1A Step-Down Voltage Regulator, 5-pin TO-263, Pb-Free; Manufacturer: Texas Instruments; PackageTopMarking: NSUZXYTTE#*LM2595S*-3.3 P+; PowerWise: N; PackageReference: KTT0005B; RoHS: Y; Code_JEDEC: MO-169-AB; PackageDescription: TO-263, Molded, .400 x .390 x .180in, 5 Lead, .067in Pitch, Surface Mount; CompType: Switcher; ComponentLink1Description: Datasheet URL; PinCount: 5; ComponentLink1URL: http://www.ti.com/general/docs/lit/getliterature.tsp?genericPartNumber=LM2595&fileType=pdf
X1 = KC2520Z8.00000C1KX00: No Description Available; Mfr_Name: KYOCERA AVX; RefDes: RefDes; Type: Type